# EAGLE design encoder_breakout (EAGLE 8.5.2)
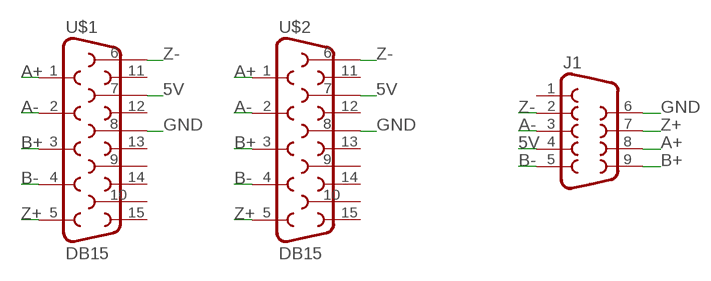
[diagram p0: schematic, sheet 1]

## Parts
J1  DB9FEMALE  [DB9]
U$1  DB15  [DB15]
U$2  DB15  [DB15]

## Nets
5V: J1.4 U$1.7 U$2.7
A+: J1.8 U$1.1 U$2.1
A-: J1.3 U$1.2 U$2.2
B+: J1.9 U$1.3 U$2.3
B-: J1.5 U$1.4 U$2.4
GND: J1.6 U$1.8 U$2.8
Z+: J1.7 U$1.5 U$2.5
Z-: J1.2 U$1.6 U$2.6
Unconnected: J1.1 U$1.9 U$1.10 U$1.11 U$1.12 U$1.13 U$1.14 U$1.15 U$2.9 U$2.10 U$2.11 U$2.12 U$2.13 U$2.14 U$2.15

## Library data of the parts
J1 = SparkFun-Connectors:DB9: DB9 Connector Standard DB9 (D-Sub 9) serial connector. Can be used for CAN bus as well as RS485 and RS232. Footprint production proven. Spark Fun Electronics SKU : PRT-00429; PROD_ID: CONN-08194
U$1 U$2 = SparkFun-Connectors:DB15: DB15 / VGA right angle through-hole female connector.

## Board
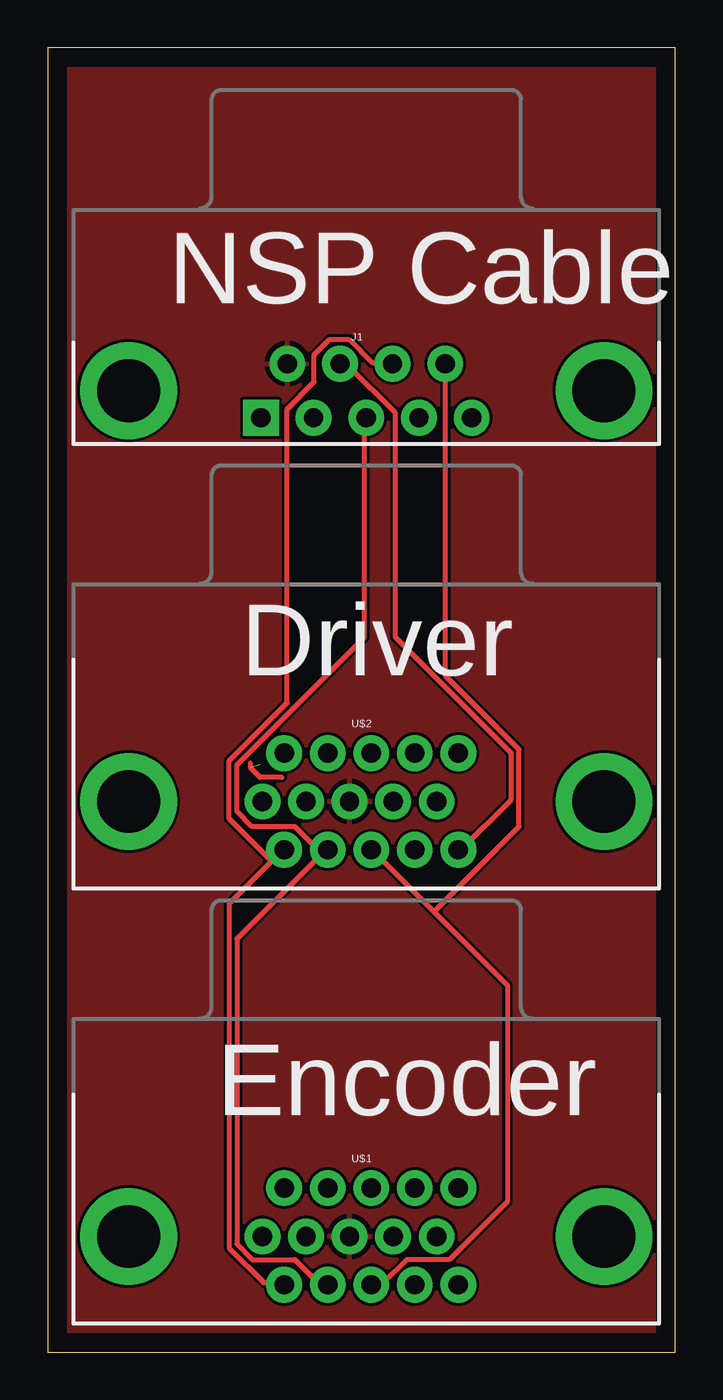
[diagram p1: board, top side]
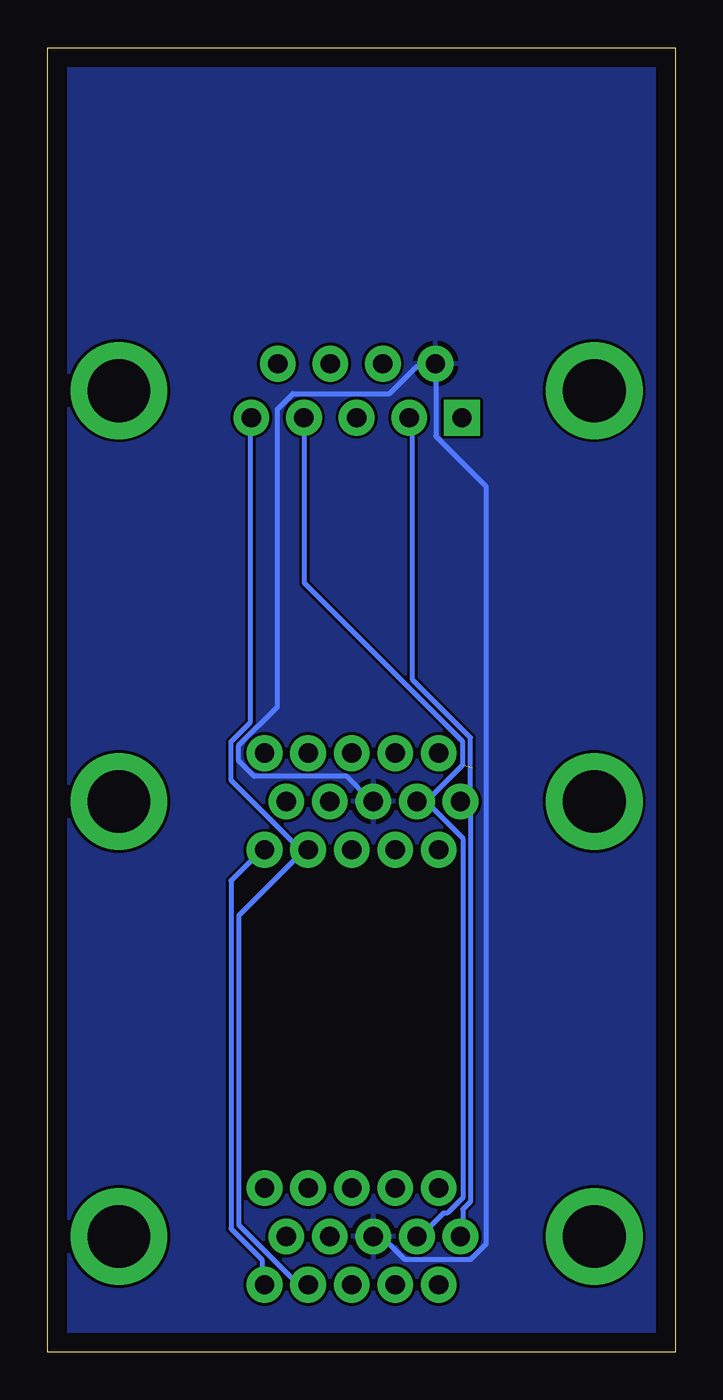
[diagram p2: board, bottom side, seen from below]

Size 33.02 x 68.58 mm. Coordinates in mm from the lower left corner, seen from the top.
Outline: 0,0 33.02,0 33.02,68.58 0,68.58 0,0
Copper layers (1*16): Top 0.035mm / dielectric 1.5mm / Bottom 0.035mm
Design rules "default *": minimum track width 10mil, minimum drill 0.35mm, track to track 6mil, track to pad 6mil, pad to pad 6mil, via to via 6mil, smd to smd 6mil, copper to edge 40mil, drill to drill 6mil, minimum pad ring 10mil, minimum via ring 8mil, stop-mask expansion 4mil, vias tented up to drill 0mil, thermal gap 10mil

### Footprints (pad centres in the part's own frame; a part is rotated, then mirrored left to right if it is on the bottom)
DB9 = drill 1.016 pad 1.88 square: 1 -5.54,-1.42 | drill 1.016 pad 1.88: 2 -2.77,-1.42; 3 0,-1.42; 4 2.77,-1.42; 5 5.54,-1.42; 6 -4.15,1.42; 7 -1.38,1.42; 8 1.38,1.42; 9 4.15,1.42 | drill 3.302 pad 5.08: G1 -12.5,0; G2 12.5,0
DB15 = drill 1.016 pad 1.88: 1 -4.32,-7.62; 2 -2.03,-7.62; 3 0.26,-7.62; 4 2.55,-7.62; 5 4.84,-7.62; 6 -5.46,-5.08; 7 -3.17,-5.08; 8 -0.88,-5.08; 9 1.41,-5.08; 10 3.7,-5.08; 11 -4.32,-2.54; 12 -2.03,-2.54; 13 0.26,-2.54; 14 2.55,-2.54; 15 4.84,-2.54 | drill 3.302 pad 5.08: G1 -12.5,-5.08; G2 12.5,-5.08

### Placement (x,y rotation side)
J1  16.76,50.55 0 top
U$1  16.76,11.18 0 top
U$2  16.76,34.04 0 top

### Tracks (layer width: path | path; a pad name or v marks a point on that pad's centre or on a via)
5V  (1 unrouted)
  Top 0.254: 12.32,30.23 11.18,30.23 10.67,30.73 10.67,30.99
  Bottom 0.254: 13.21,29.06 13.41,29.06 U$2.7 13.21,29.06 | 13.21,29.06 13.01,29.06 11.18,30.89 11.18,32.11 19.51,40.44 19.51,48.97 J1.4 | 13.21,29.06 11.18,27.03 11.18,8.13 11.99,7.32 12.19,7.32 13.41,6.1 U$1.7
A+
  Top 0.254: 11.79,25.81 12.39,26.42 U$2.1 11.79,25.81 | 11.79,25.81 9.55,23.57 9.55,5.49 11.38,3.66 12.39,3.66 U$1.1 | 11.79,25.81 9.55,28.04 9.55,31.09 12.6,34.14 12.6,49.58 14.02,51 14.02,52.43 14.83,53.24 15.85,53.24 17.07,52.02 18.09,52.02 J1.8
A-
  Top 0.254: 14.43,26.21 14.63,26.42 U$2.2 14.43,26.21 | 14.43,26.21 9.96,21.74 9.96,5.69 10.77,4.88 13.01,4.88 14.22,3.66 14.63,3.66 U$1.2 | 14.43,26.21 13.01,27.64 10.77,27.64 9.96,28.45 9.96,30.89 16.66,37.59 16.66,48.97 J1.3
B+
  Top 0.254: 20.32,23.16 17.07,26.42 U$2.3 | 20.32,23.16 24.18,19.3 24.18,7.92 21.13,4.88 18.9,4.88 17.68,3.66 17.07,3.66 U$1.3 | 20.32,23.16 24.79,27.64 24.79,31.7 20.93,35.56 20.93,51.82 J1.9
B-
  Bottom 0.254: 19.51,26.42 22.96,22.96 22.96,6.71 19.91,3.66 19.51,3.66 U$1.4 | 19.51,26.42 19.71,26.42 23.37,30.07 23.37,32.11 22.35,33.12 22.35,48.97 J1.5 | 19.51,26.42 U$2.4
GND
  Bottom 0.254: U$2.8 16.05,29.06 17.27,30.28 22.15,30.28 22.96,31.09 22.96,31.9 20.93,33.93 20.93,49.58 20.12,50.39 15.04,50.39 13.61,51.82 12.8,51.82 J1.6 12.6,51.82 12.6,48.16 9.96,45.52 9.96,5.69 10.77,4.88 14.22,4.88 15.44,6.1 U$1.8
  pour Top: 0,68.58 33.02,68.58 33.02,0 0,0
  pour Bottom: 0,68.58 33.02,68.58 33.02,0 0,0
Z+
  Top 0.254: J1.7 15.44,51.82 15.85,51.82 18.29,49.38 18.29,37.59 24.38,31.5 24.38,29.06 21.74,26.42 U$2.5
  Bottom 0.254: U$1.5 21.74,3.66 21.74,4.88 23.37,6.5 23.37,24.79 21.74,26.42 U$2.5
Z-
  Bottom 0.254: U$1.6 11.18,6.1 11.18,7.52 10.77,7.92 10.77,28.45 11.18,28.85 U$2.6 11.18,29.06 10.77,29.46 10.77,32.31 13.82,35.36 13.82,48.97 J1.2

### Text on the board
tNames: NSP Cable | Driver | Encoder